# EAGLE schematic Schematic (EAGLE 9.5.2)
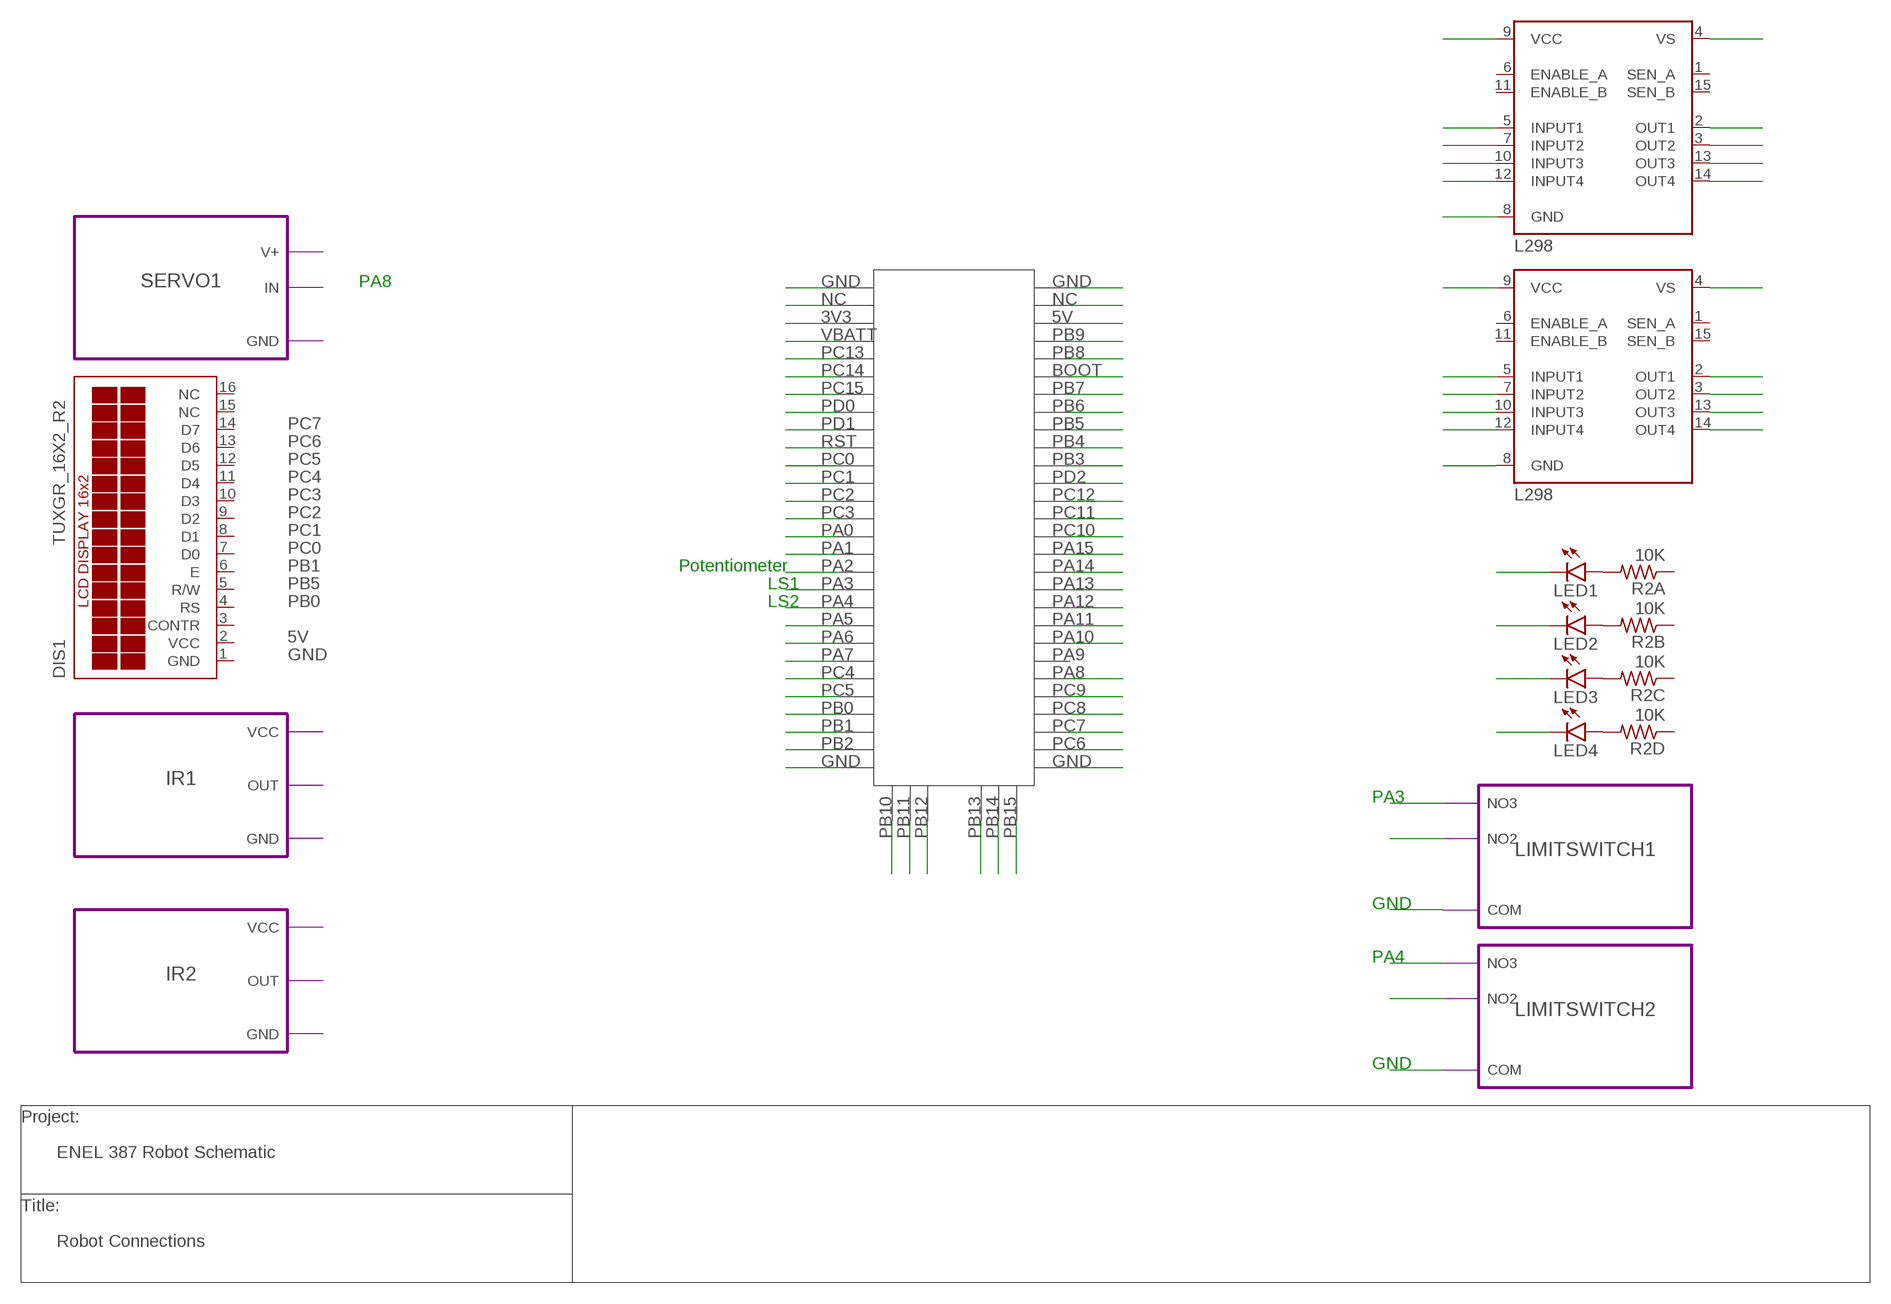
[diagram p0: schematic, sheet 1]

## Parts
DIS1  TUXGR_16X2_R2  [TUXGR_16X2_R2]
IC1  L298  [MULTIWATT-15]
IC2  L298  [MULTIWATT-15]
LED1  LEDLZR181  [LZR181]
LED2  LEDLZR181  [LZR181]
LED3  LEDLZR181  [LZR181]
LED4  LEDLZR181  [LZR181]
R2A  10K  R-US_0309/12  [0309/12]
R2B  10K  R-US_0309/12  [0309/12]
R2C  10K  R-US_0309/12  [0309/12]
R2D  10K  R-US_0309/12  [0309/12]

## Module instances
IR1 = IR
IR2 = IR
SERVO1 = SERVO
LIMITSWITCH1 = LIMITSWITCH
LIMITSWITCH2 = LIMITSWITCH

## Nets
N$21: IC1.5(INPUT1)
N$62: port LIMITSWITCH1.COM
N$69: IC1.7(INPUT2)
N$71: IC1.10(INPUT3)
N$72: IC1.12(INPUT4)
N$73: IC1.8(GND)
N$74: IC1.9(VCC)
N$75: IC1.4(VS)
N$76: IC1.2(OUT1)
N$77: IC1.3(OUT2)
N$78: IC1.13(OUT3)
N$79: IC1.14(OUT4)
N$80: LED4.A R2D.2
N$81: LED3.A R2C.2
N$82: LED2.A R2B.2
N$83: LED1.A R2A.2
N$84: LED4.K(C)
N$85: LED3.K(C)
N$86: LED2.K(C)
N$87: LED1.K(C)
N$88: IC2.5(INPUT1)
N$89: IC2.7(INPUT2)
N$90: IC2.10(INPUT3)
N$91: IC2.12(INPUT4)
N$92: IC2.8(GND)
N$93: IC2.9(VCC)
N$94: IC2.4(VS)
N$95: IC2.2(OUT1)
N$96: IC2.3(OUT2)
N$97: IC2.13(OUT3)
N$98: IC2.14(OUT4)
Unconnected: DIS1.3(CONTR) DIS1.4(RS) DIS1.5(R/W) DIS1.6(E) DIS1.7(D0) DIS1.8(D1) DIS1.9(D2) DIS1.10(D3) DIS1.11(D4) DIS1.12(D5) DIS1.13(D6) DIS1.14(D7) DIS1.15(NC) DIS1.16(NC) IC1.1(SEN_A) IC1.6(ENABLE_A) IC1.11(ENABLE_B) IC1.15(SEN_B) IC2.1(SEN_A) IC2.6(ENABLE_A) IC2.11(ENABLE_B) IC2.15(SEN_B) R2A.1 R2B.1 R2C.1 R2D.1

## Notes on the sheet
- Motor Controller | Motor Controller 1
- 12V | 5V
- PB6
- PB7
- PB3 | M1+
- PB4 | M1-
- PB10 | M2+
- PB11 | M2-
- GND
- 5V
- STM32F100RB | Motor Controller | Motor Controller 2
- PA8 | GND | GND | 12V | 5V
- NC | NC
- 3V3 | 5V | PB8
- GND | VBATT | PB9 | MC2_ENB | PB9
- PC13 | PB8 | MC2_ENA
- PC14 | BOOT | PB12 | M3+
- PC15 | PB7 | MC_ENB | PB13 | M3-
- PD0 | PB6 | MC_ENA | PB14 | M4+
- PC7 | PD1 | PB5 | LCD_RW | PB15 | M4-
- PC6 | RST | PB4 | MC_I2
- PC5 | LCD0 | PC0 | PB3 | MC_I1 | GND
- PC4 | LCD1 | PC1 | PD2 | T1
- PC3 | LCD2 | PC2 | PC12
- PC2 | LCD3 | PC3 | PC11
- PC1 | PA0 | PC10
- PC0 | PA1 | PA15
- PB1 | Potentiometer | PA2 | PA14 | PA9 | 3.3V
- PB5 | LS1 | PA3 | PA13
- PB0 | LS2 | PA4 | PA12 | LED_4
- IR2 | PA5 | PA11 | LED_3 | PA10
- 5V | PA6 | PA10 | LED_2
- GND | PA7 | PA9 | LED_1
- LCD4 | PC4 | PA8 | Servo_in | PA11
- LCD5 | PC5 | PC9
- LCD_RS | PB0 | PC8 | IR1
- 5V | LCD_ENA | PB1 | PC7 | LCD7 | PA12
- PB2 | PC6 | LCD6
- GND | GND
- PC8
- PA3
- GND | PB10 | PB11 | PB12 | PB13 | PB14 | PB15
- GND
- 5V | MC_I3 | MC_I4 | MC2_I1 | MC2_I2 | MC2_I3 | MC2_I4
- PA4
- PA5
- GND
- GND
- Project:
- ENEL 387 Robot Schematic
- Title:
- Robot Connections

## Power pins joined to a net without a drawn wire
GND: DIS1.1(GND)
VCC: DIS1.2(VCC)

## Library data of the parts
DIS1 = display-lcd:TUXGR_16X2_R2: Tuxgraphics LCD display 16x2 characters reflective, without background light Source: tuxgr_12x2_r2.pdf; OC_FARNELL: unknown; OC_NEWARK: unknown
IC1 IC2 = st-microelectronics:L298: DUAL FULL-BRIDGE DRIVER; MPN: L298N; OC_FARNELL: 1589425; OC_NEWARK: 32M1527
LED1-LED4 = led:LED: LED OSRAM: - CHIPLED LG R971, LG N971, LY N971, LG Q971, LY Q971, LO R971, LY R971 LH N974, LH R974 LS Q976, LO Q976, LY Q976 LO Q996 - Hyper CHIPLED LW Q18S LB Q993, LB Q99A, LB R99A - SideLED LS A670, LO A670, LY A670, LG A670, LP A670 LB A673, LV A673, LT A673, LW A673 LH A674 LY A675 LS A676, LA A676, LO A676, LY A676, LW A676 LS A679, LY A679, LG A679 - Hyper Micro SIDELED® LS Y876, LA Y876, LO Y876, LY Y876 LT Y87S - SmartLED LW L88C, LW L88S LB L89C, LB L89S, LG L890 LS L89K, LO L89K, LY L89K LS L896, LA L896, LO L896, LY L896 - TOPLED LS T670, LO T670, LY T670, LG T670, LP T670 LSG T670, LSP T670, LSY T670, LOP T670, LYG T670 LG T671, LOG T671, LSG T671 LB T673, LV T673, LT T673, LW T673 LH T674 LS T676, LA T676, LO T676, LY T676, LB T676, LH T676, LSB T676, LW T676 LB T67C, LV T67C, LT T67C, LS T67K, LO T67K, LY T67K, LW E67C LS E67B, LA E67B, LO E67B, LY E67B, LB E67C, LV E67C, LT E67C LW T67C LS T679, LY T679, LG T679 LS T770, LO T770, LY T770, LG T770, LP T770 LB T773, LV T773, LT T773, LW T773 LH T774 LS E675, LA E675, LY E675, LS T675 LS T776, LA T776, LO T776, LY T776, LB T776 LHGB T686 LT T68C, LB T68C - Hyper Mini TOPLED® LB M676 - Mini TOPLED Santana® LG M470 LS M47K, LO M47K, LY M47K Source: http://www.osram.convergy.de LUXEON: - LUMILED® LXK2-PW12-R00, LXK2-PW12-S00, LXK2-PW14-U00, LXK2-PW14-V00 LXK2-PM12-R00, LXK2-PM12-S00, LXK2-PM14-U00 LXK2-PE12-Q00, LXK2-PE12-R00, LXK2-PE12-S00, LXK2-PE14-T00, LXK2-PE14-U00 LXK2-PB12-K00, LXK2-PB12-L00, LXK2-PB12-M00, LXK2-PB14-N00, LXK2-PB14-P00, LXK2-PB14-Q00 LXK2-PR12-L00, LXK2-PR12-M00, LXK2-PR14-Q00, LXK2-PR14-R00 LXK2-PD12-Q00, LXK2-PD12-R00, LXK2-PD12-S00 LXK2-PH12-R00, LXK2-PH12-S00 LXK2-PL12-P00, LXK2-PL12-Q00, LXK2-PL12-R00 Source: www.luxeon.com KINGBRIGHT: KA-3528ASYC Source: www.kingbright.com
R2A R2B R2C R2D = rcl:R-US_: RESISTOR, American symbol; SPICEPREFIX: R

## Module SERVO
Ports: V+(io) GND(io) IN(io)

### Library data of the parts

## Module IR
Ports: VCC(io) GND(io) OUT(io)

### Library data of the parts

## Module UTLRASONIC
Ports: VCC(io) GND(io) TRIG(io) ECHO(io)

### Library data of the parts

## Module LIMITSWITCH
Ports: COM(io) NO2(io) NO3(io)

### Library data of the parts

## Module TEMPERATURE
Ports: GND(io) VCC(io) DATA(io)

### Library data of the parts

## Module STM32
Ports: 

### Library data of the parts

## Module STM32F100RB
Ports: GND(io) NC(io) 3V3(io) VBATT(io) PC13(io) PC14(io) PC15(io)

### Library data of the parts

## Module STMF100
Ports: GND(io) NC(io) 3V3(io) VBATT(io) PC13(io) PC14(io) PC15(io) PD0(io) PD1(io) RST(io) PC0(io) PC1(io) PC2(io) PC3(io) PA0(io) PA1(io) PA2(io) PA3(io) PA4(io) PA5(io) PA6(io) PA7(io) PC4(io) PC5(io) PB0(io) PB1(io) PB2(io) 5V(io) PB9(io) PB8(io) BOOT(io) PB7(io) PB6(io) PB5(io) PB4(io) PB3(io) PD2(io) PC12(io) PC11(io) PC10(io) PA15(io) PA14(io) PA13(io) PA12(io) PA11(io) PA10(io) PA9(io) PA8(io) PC9(io) PC8(io) PC7(io) PC6(io) PB10(io) PB11(io) PB12(io) PB15(io) PB14(io) PB13(io)

### Library data of the parts